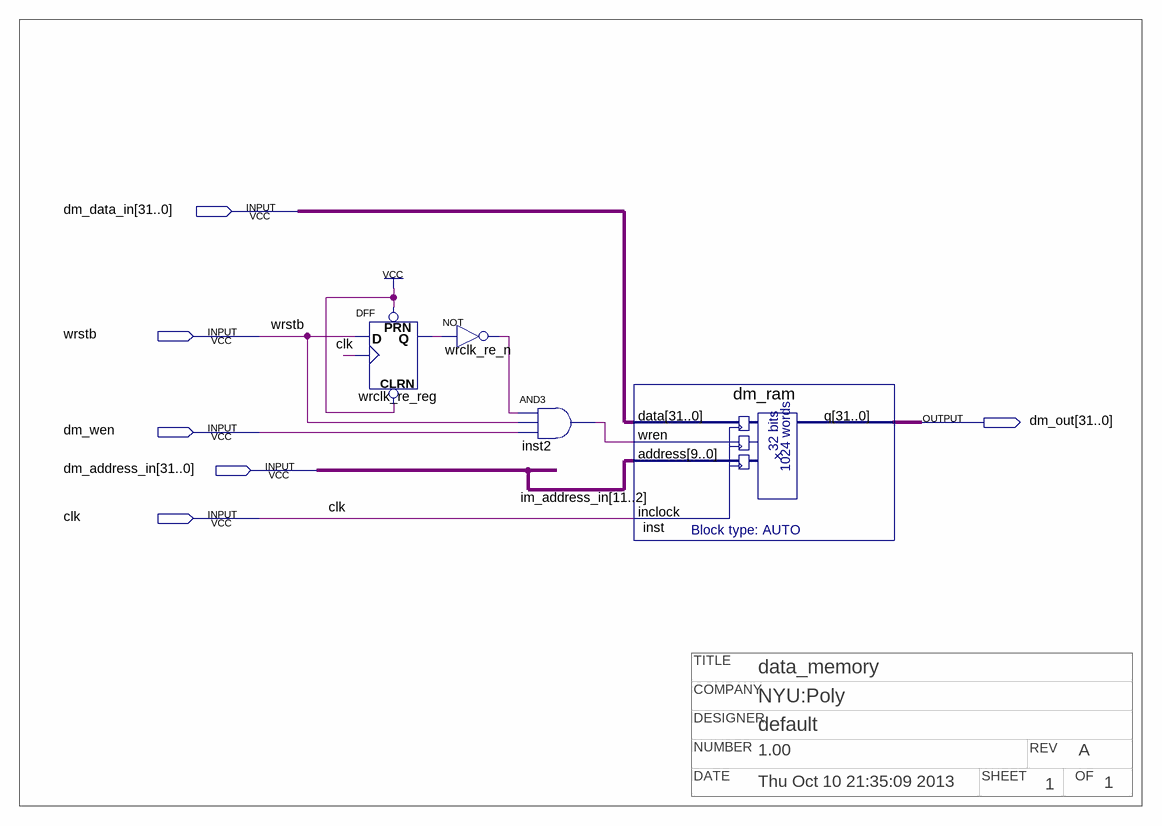
[diagram p0: schematic sheet]
// Quartus schematic dm.bdf as structural Verilog: 4 symbols, 6 pins
// Title block: COMPANY: NYU:Poly; DATE: Thu Oct 10 21:35:09 2013; DESIGNER: default; NUMBER: 1.00; OF: 1; REV: A; SHEET: 1; TITLE: data_memory
module dm (
  input  [31:0] dm_data_in,
  input  wrstb,
  input  dm_wen,
  input  [31:0] dm_address_in,
  input  clk,
  output [31:0] dm_out
);

  wire wrclk_1_not, wren, wrstb_1;

  DFF wrclk_re_reg (.CLRN(1'b1), .CLK(clk), .D(wrstb), .PRN(1'b1), .Q(wrstb_1));
  not wrclk_re_n (wrclk_1_not, wrstb_1);
  and inst2 (wren, wrclk_1_not, wrstb, dm_wen);
  dm_ram inst (.data(dm_data_in), .wren(wren), .address(dm_address_in[11:2]), .inclock(clk), .q(dm_out));

  // Other names for the same wires on the sheet: im_address_in[31:0] = dm_address_in; im_out[31:0] = dm_out
endmodule
